# Altium schematic sheet Sheet1.SchDoc
size A4; SheetNumber: 1; SheetTotal: 1; SPICEModelCacheICIJCJVI: <root> / <DocumentId>ICIJCJVI</DocumentId> / </root>
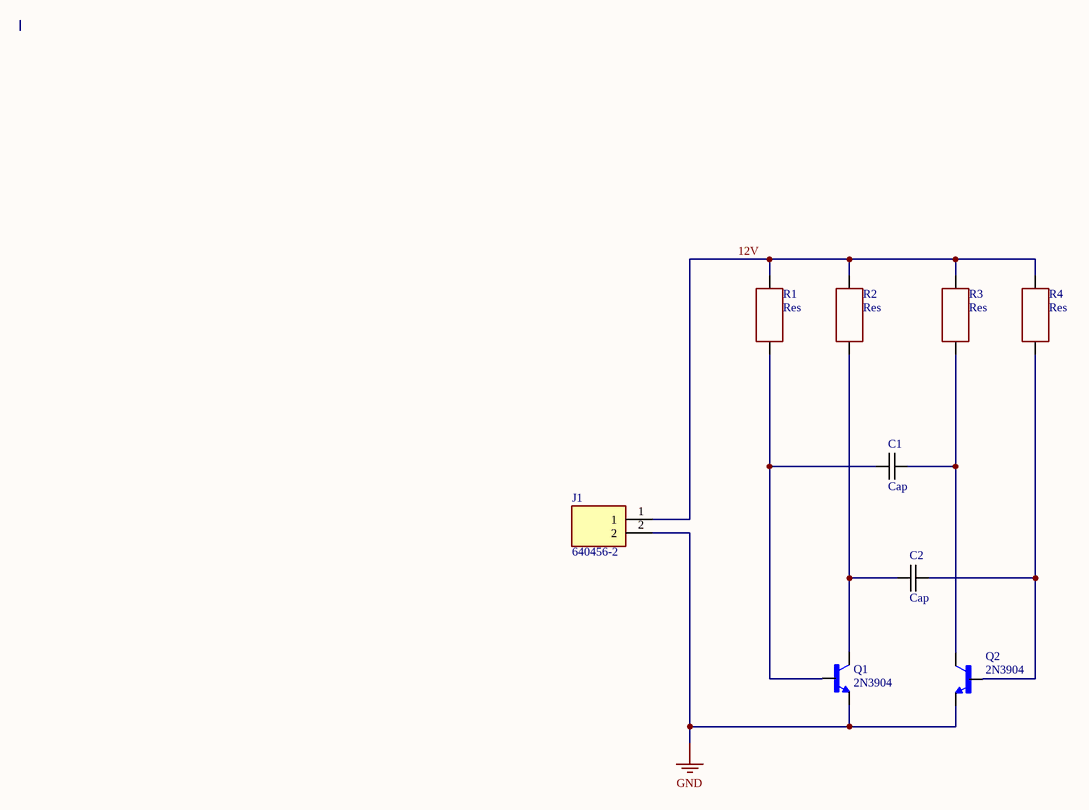
[diagram p0: Sheet1.SchDoc]

## Parts
C1  Cap  [Cap]
C2  Cap  [Cap]
J1  640456-2  [TE_640456-2]
Q1  2N3904  [TO92254P460H750-3]
Q2  2N3904  [TO92254P460H750-3]
R1  Res  [Res 1]
R2  Res  [Res 1]
R3  Res  [Res 1]
R4  Res  [Res 1]

## Nets
GND: J1.2 Q1.1(E) Q2.1(E)
12V: J1.1 R1.2 R2.2 R3.2 R4.2
NetC1_1: C1.1 Q1.2(B) R1.1
NetC1_2: C1.2 Q2.3(C) R3.1
NetC2_1: C2.1 Q1.3(C) R2.1
NetC2_2: C2.2 Q2.2(B) R4.1

## Library data of the parts
J1 = 640456-2: Header Friction Lock MTA-100 2 250 VAC Polyester Tin Copper Alloy Tin | TE Connectivity 640456-2; SnapEDA_Link: https://www.snapeda.com/parts/640456-2/TE+Connectivity+AMP+Connectors/view-part/?ref=snap; Package: None; Value: *; MF: TE Connectivity; MP: 640456-2; Check_prices: https://www.snapeda.com/parts/640456-2/TE+Connectivity+AMP+Connectors/view-part/?ref=eda
Q1 Q2 = 2N3904: BJT, TO-92, 40V, 200mA, NPN, 0.625W, 150Â°C; MF: Diotec Semiconductor; SnapEDA_Link: https://www.snapeda.com/parts/2N3904/Diotec/view-part/?ref=snap; Package: TO-92 Diotec; Value: *; MP: 2N3904; Check_prices: https://www.snapeda.com/parts/2N3904/Diotec/view-part/?ref=eda